# EasyEDA schematic SCH_WasserQualliSensor V1.1_2022-12-06.json
TITLE: Water Quality Sensor; REV: 1.0; Date: 2021-07-04; Sheet: 1/1; Drawn By: Tobias Kanaske; Company: HHZ
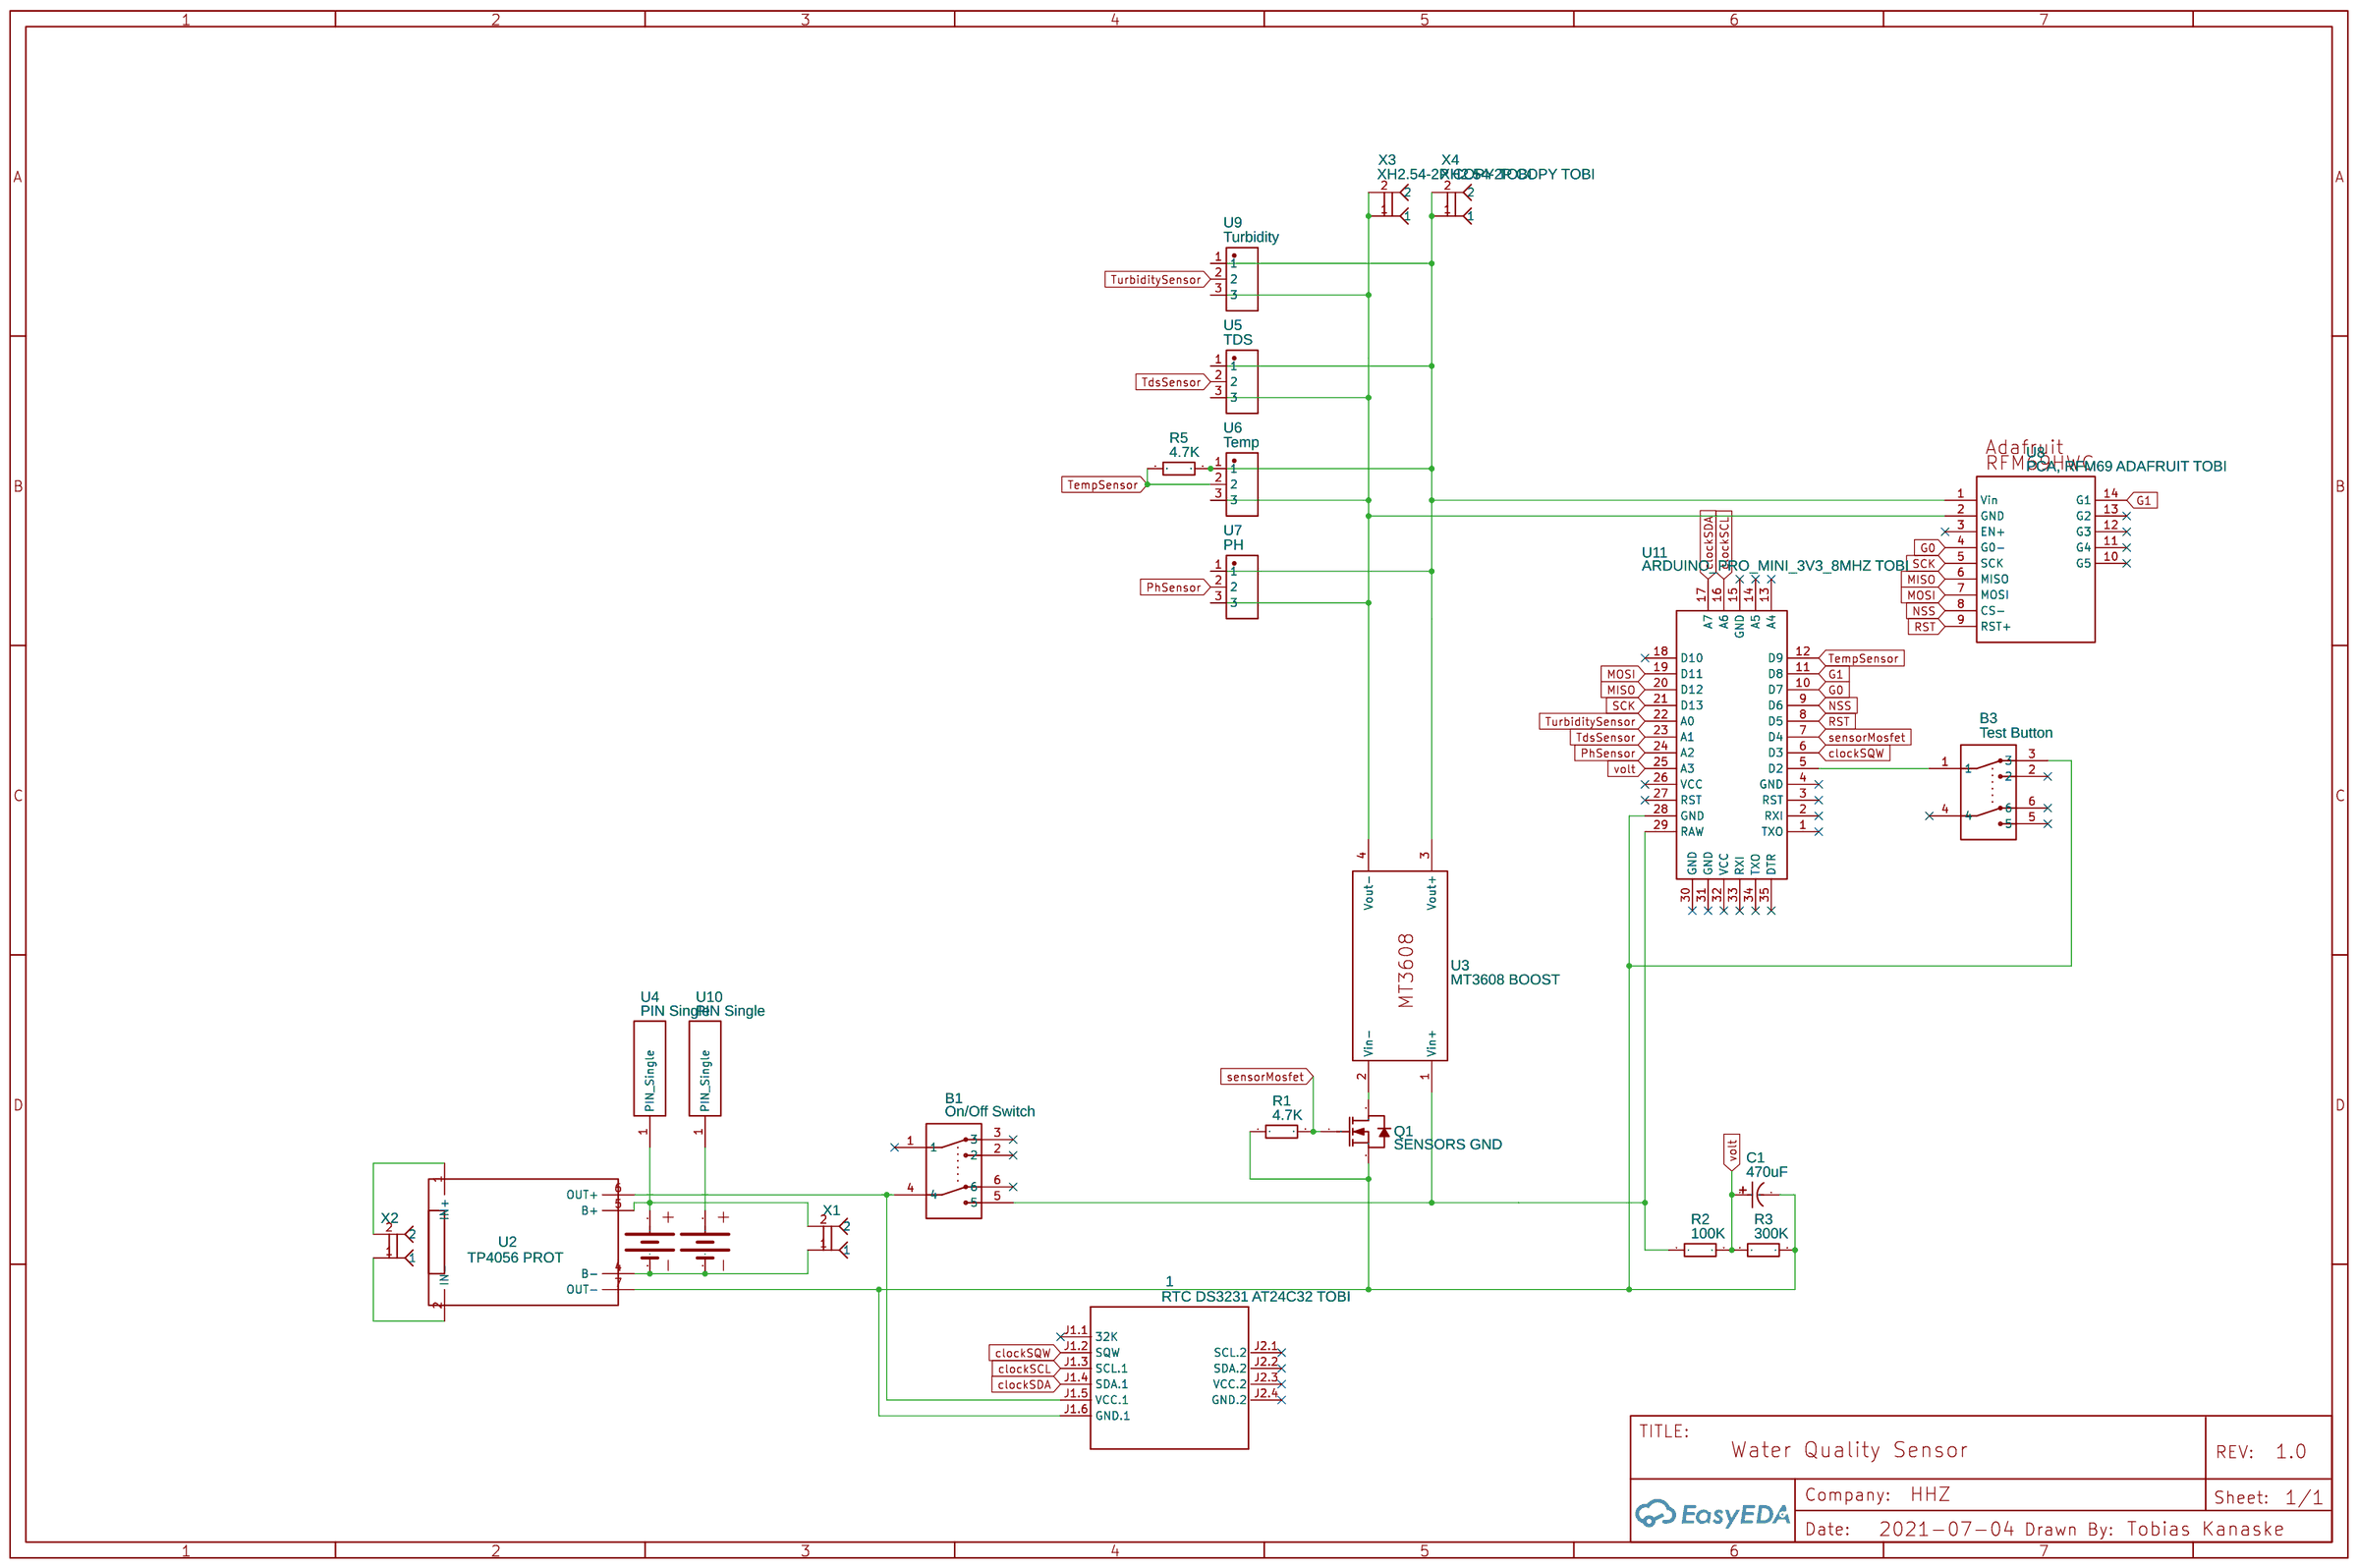
[diagram p0: schematic sheet]

## Parts
1  RTC DS3231 AT24C32 TOBI  [RTC-DS3231-AT24C32]
3.1V  18650  [18650 BATTERY WITH SMD HOLDER]
4.2V  18650  [18650 BATTERY WITH SMD HOLDER]
B1  On/Off Switch  [LATCHING SWITCH BUTTON 8*8 6 PIN]
B3  Test Button  [LATCHING SWITCH BUTTON 8*8 6 PIN]
C1  470uF  [CAP-TH_BD6.3-P2.50-D1.0-FD]
Q1  SENSORS GND  [TO-220-3_L10.0-W4.5-P2.54-T]
R1  4.7K  [RES-TH_BD2.3-L6.5-P10.50-D0.5]
R2  100K  [RES-TH_BD2.3-L6.5-P10.50-D0.5]
R3  300K  [RES-TH_BD2.3-L6.5-P10.50-D0.5]
R5  4.7K  [RES-TH_BD2.3-L6.5-P10.50-D0.5]
U2  TP4056 PROT  [TP4056-PROTECT]
U3  MT3608 BOOST  [MT3608]
U4  PIN Single  [SINGLE PIN 1.5]
U5  TDS  [CONN-TH_XH2.54-3P]
U6  Temp  [CONN-TH_XH2.54-3P]
U7  PH  [CONN-TH_XH2.54-3P]
U8  PCA, RFM69 ADAFRUIT TOBI  [PCA ADAFRUIT RFM69HWC RADIO]
U9  Turbidity  [CONN-TH_XH2.54-3P]
U10  PIN Single  [SINGLE PIN 1.5]
U11  ARDUINO_PRO_MINI_3V3_8MHZ TOBI  [ARDUINO_PRO_MINI_3V3_8MHZ_TOBI]
X1  XH2.54-2P  [XH2.54-2P]
X2  XH2.54-2P  [XH2.54-2P]
X3  XH2.54-2P COPY TOBI  [XH2.54-2P]
X4  XH2.54-2P COPY TOBI  [XH2.54-2P]

## Library data of the parts
1 = RTC DS3231 AT24C32 TOBI: Contributor: hollandacocobear
3.1V 4.2V = 18650 SMD HOLDER 1S: Battery Holder; Contributor: yudhabhakti95
B1 B3 = LATCHING SWITCH BUTTON 8*8 6 PIN TOBI: Contributor: hamontutan86
C1 = KAPACITOR 470UF 16V 6.3*12 TOBI: Supplier: LCSC; Manufacturer: ValuePro; Manufacturer Part: 470uF 16V 6.3*12; Supplier Part: C43809; JLCPCB Part Class: Extended Part
Q1 = NPN MOSFET IRLZ44NPBF TOBI: Supplier: LCSC; Manufacturer: IR; Manufacturer Part: IRLZ44NPBF; Supplier Part: C38774; JLCPCB Part Class: Extended Part
R1-R3 R5 = RESISTOR TOBI: Supplier: LCSC; Supplier Part: C119339; Manufacturer: Chian Chia Elec; Contributor: LCSC; JLCPCB Part Class: Extended Part
U2 = TP4056 PROT TOBI: Manufacturer Part: TP4056-protect; link: https://dlnmh9ip6v2uc.cloudfront.net/datasheets/Prototyping/TP4056.pdf; Contributor: quocanhhai
U3 = MT3608 BOOST TOBI: Contributor: Ctevie
U4 U10 = PIN Single: Contributor: cubabellaro
U5-U7 U9 = XH_2.54_3P TOBI: Supplier: LCSC; Supplier Part: C9900004241; Manufacturer: null; Manufacturer Part: XH_2.54_3P; JLCPCB Part Class: Extended Part; Contributor: LCSC
U8 = PCA, RFM69 ADAFRUIT TOBI: Supplier: Digi-Key; Manufacturer: ADAFRUIT; Manufacturer Part: RFM69HCW; Supplier Part: C4746; LCSC Assembly: Yes; SMT Type: Extend; Contributor: M4386Z25Q
U11 = ARDUINO_PRO_MINI_3V3_8MHZ TOBI: Manufacturer Part: Arduino_Pro_Mini_3V3_8Mhz; link: https://www.aliexpress.com/item/Free-Shipping-1pcs-pro-mini-atmega328-Pro-Mini-328-Mini-ATMEGA328-3-3V-8MHz-for-Arduino/32340942669.html?spm=a2g0s.9042311.0.0.uDzRSW; Contributor: eagle73
X1-X4 = XH2.54-2P COPY TOBI: Contributor: Alexus-12

## Nets
clockSCL: 1.J1.3(SCL.1) U11.16(A6)
clockSDA: 1.J1.4(SDA.1) U11.17(A7)
clockSQW: 1.J1.2(SQW) U11.6(D3)
G0: U8.4(G0-) U11.10(D7)
G1: U8.14(G1) U11.11(D8)
MISO: U8.6(MISO) U11.20(D12)
MOSI: U8.7(MOSI) U11.19(D11)
NSS: U8.8(CS-) U11.9(D6)
PhSensor: U7.2 U11.24(A2)
RST: U8.9(RST+) U11.8(D5)
SCK: U8.5(SCK) U11.21(D13)
sensorMosfet: Q1.1(G) R1.2 U11.7(D4)
TdsSensor: U5.2 U11.23(A1)
TempSensor: R5.2 U6.2 U11.12(D9)
TurbiditySensor: U9.2 U11.22(A0)
volt: C1.1 R2.2 R3.1 U11.25(A3)
Net-(1-J1.5): 1.J1.5(VCC.1) B1.4 U2.6(OUT+)
Net-(1-J1.6): 1.J1.6(GND.1) B3.3 C1.2 Q1.3(S) R1.1 R3.2 U2.7(OUT-) U11.28(GND)
Net-(3.1V-1): 3.1V.1(+) U10.1(PIN Single)
Net-(3.1V-2): 3.1V.2(-) 4.2V.2(-) U2.4(B-) X1.1
Net-(4.2V-1): 4.2V.1(+) U2.5(B+) U4.1(PIN Single) X1.2
Net-(B1-5): B1.5 R2.1 U3.1(Vin+) U11.29(RAW)
Net-(B3-1): B3.1 U11.5(D2)
Net-(Q1-2): Q1.2(D) U3.2(Vin-)
Net-(R5-1): R5.1 U3.3(Vout+) U5.1 U6.1 U7.1 U8.1(Vin) U9.1 X4.1 X4.2
Net-(U2-1): U2.1(IN+) X2.2
Net-(U2-2): U2.2(IN-) X2.1
Net-(U3-4): U3.4(Vout-) U5.3 U6.3 U7.3 U8.2(GND) U9.3 X3.1 X3.2

Not connected (* = marked no-connect by the designer): 1 J1.1(32K)* J2.1(SCL.2)* J2.2(SDA.2)* J2.3(VCC.2)* J2.4(GND.2)*; B1 1* 2* 3* 6*; B3 2* 4* 5* 6*; U8 3(EN+)* 10(G5)* 11(G4)* 12(G3)* 13(G2)*; U11 1(TXO)* 2(RXI)* 3(RST)* 4(GND)* 13(A4)* 14(A5)* 15(GND)* 18(D10)* 26(VCC)* 27(RST)* 30(GND)* 31(GND)* 32(VCC)* 33(RXI)* 34(TXO)* 35(DTR)*
